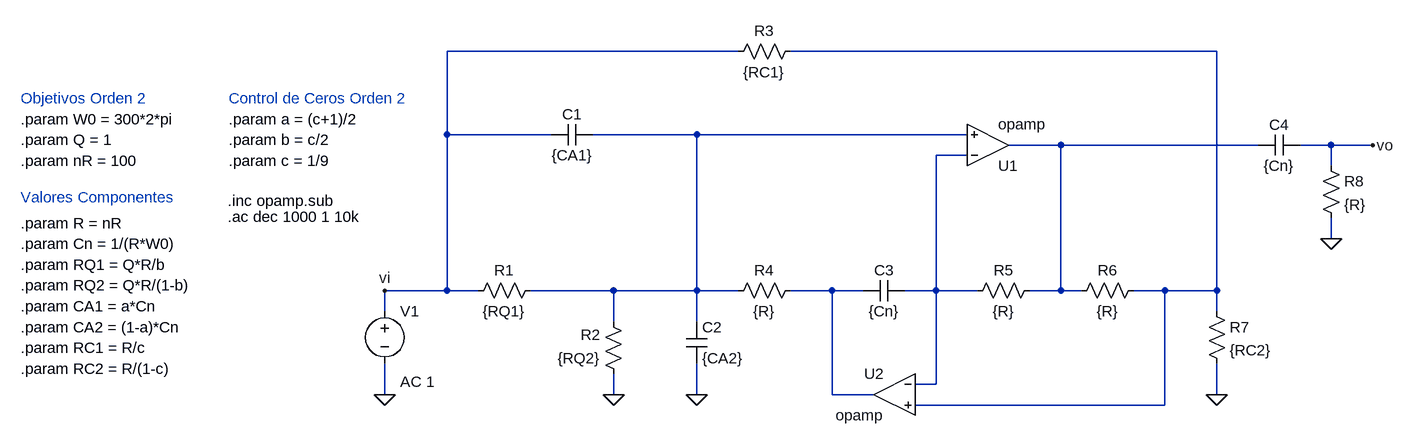
[diagram p0: schematic implementacion2(Schawmann).asc]
implementacion2(Schawmann).asc, the LTspice schematic file:
Version 4
SHEET 1 2268 680
WIRE 992 0 544 0
WIRE 1728 0 1072 0
WIRE 544 128 544 0
WIRE 704 128 544 128
WIRE 928 128 768 128
WIRE 1344 128 928 128
WIRE 1488 144 1408 144
WIRE 1792 144 1488 144
WIRE 1904 144 1856 144
WIRE 1968 144 1904 144
WIRE 1344 160 1296 160
WIRE 1904 176 1904 144
WIRE 1904 288 1904 256
WIRE 544 368 544 128
WIRE 544 368 448 368
WIRE 592 368 544 368
WIRE 800 368 672 368
WIRE 928 368 928 128
WIRE 928 368 800 368
WIRE 992 368 928 368
WIRE 1136 368 1072 368
WIRE 1184 368 1136 368
WIRE 1296 368 1296 160
WIRE 1296 368 1248 368
WIRE 1360 368 1296 368
WIRE 1488 368 1488 144
WIRE 1488 368 1440 368
WIRE 1520 368 1488 368
WIRE 1648 368 1600 368
WIRE 1728 368 1728 0
WIRE 1728 368 1648 368
WIRE 448 400 448 368
WIRE 1728 400 1728 368
WIRE 800 416 800 368
WIRE 928 416 928 368
WIRE 1296 512 1296 368
WIRE 1296 512 1264 512
WIRE 448 528 448 480
WIRE 800 528 800 496
WIRE 928 528 928 480
WIRE 1136 528 1136 368
WIRE 1200 528 1136 528
WIRE 1728 528 1728 480
WIRE 1648 544 1648 368
WIRE 1648 544 1264 544
FLAG 448 528 0
FLAG 800 528 0
FLAG 928 528 0
FLAG 1728 528 0
FLAG 1904 288 0
FLAG 448 368 vi
FLAG 1968 144 vo
SYMBOL voltage 448 384 R0
WINDOW 123 24 124 Left 2
WINDOW 39 0 0 Left 0
SYMATTR InstName V1
SYMATTR Value ""
SYMATTR Value2 AC 1
SYMBOL res 688 352 R90
WINDOW 0 0 56 VBottom 2
WINDOW 3 32 56 VTop 2
SYMATTR InstName R1
SYMATTR Value {RQ1}
SYMBOL res 1088 352 R90
WINDOW 0 0 56 VBottom 2
WINDOW 3 32 56 VTop 2
SYMATTR InstName R4
SYMATTR Value {R}
SYMBOL res 816 512 R180
WINDOW 0 36 76 Left 2
WINDOW 3 36 40 Left 2
SYMATTR InstName R2
SYMATTR Value {RQ2}
SYMBOL cap 912 416 R0
SYMATTR InstName C2
SYMATTR Value {CA2}
SYMBOL cap 1248 352 R90
WINDOW 0 0 32 VBottom 2
WINDOW 3 32 32 VTop 2
SYMATTR InstName C3
SYMATTR Value {Cn}
SYMBOL res 1456 352 R90
WINDOW 0 0 56 VBottom 2
WINDOW 3 32 56 VTop 2
SYMATTR InstName R5
SYMATTR Value {R}
SYMBOL res 1616 352 R90
WINDOW 0 0 56 VBottom 2
WINDOW 3 32 56 VTop 2
SYMATTR InstName R6
SYMATTR Value {R}
SYMBOL res 1712 384 R0
SYMATTR InstName R7
SYMATTR Value {RC2}
SYMBOL cap 768 112 R90
WINDOW 0 0 32 VBottom 2
WINDOW 3 32 32 VTop 2
SYMATTR InstName C1
SYMATTR Value {CA1}
SYMBOL res 1088 -16 R90
WINDOW 0 0 56 VBottom 2
WINDOW 3 32 56 VTop 2
SYMATTR InstName R3
SYMATTR Value {RC1}
SYMBOL OpAmps\\opamp 1376 208 M180
SYMATTR InstName U1
SYMBOL OpAmps\\opamp 1232 464 M0
SYMATTR InstName U2
SYMBOL cap 1856 128 R90
WINDOW 0 0 32 VBottom 2
WINDOW 3 32 32 VTop 2
SYMATTR InstName C4
SYMATTR Value {Cn}
SYMBOL res 1888 160 R0
SYMATTR InstName R8
SYMATTR Value {R}
TEXT -112 72 Left 2 ;Objetivos Orden 2
TEXT 208 72 Left 2 ;Control de Ceros Orden 2
TEXT -112 224 Left 2 ;Valores Componentes
TEXT -112 104 Left 2 !.param W0 = 300*2*pi
TEXT -112 136 Left 2 !.param Q = 1
TEXT -112 168 Left 2 !.param nR = 100
TEXT 208 104 Left 2 !.param a = (c+1)/2
TEXT 208 136 Left 2 !.param b = c/2
TEXT 208 168 Left 2 !.param c = 1/9
TEXT -112 264 Left 2 !.param R = nR
TEXT -112 296 Left 2 !.param Cn = 1/(R*W0)
TEXT -112 328 Left 2 !.param RQ1 = Q*R/b
TEXT -112 360 Left 2 !.param RQ2 = Q*R/(1-b)
TEXT -112 392 Left 2 !.param CA1 = a*Cn
TEXT -112 424 Left 2 !.param CA2 = (1-a)*Cn
TEXT -112 456 Left 2 !.param RC1 = R/c
TEXT -112 488 Left 2 !.param RC2 = R/(1-c)
TEXT 206 254 Left 2 !.ac dec 1000 1 10k
TEXT 206 230 Left 2 !.inc opamp.sub

The netlist it stands for:
* implementacion2(Schawmann).asc
V1 vi 0 AC 1
R1 N002 vi {RQ1}
R4 N005 N002 {R}
R2 0 N002 {RQ2}
C2 N002 0 {CA2}
C3 N004 N005 {Cn}
R5 N003 N004 {R}
R6 N001 N003 {R}
R7 N001 0 {RC2}
C1 N002 vi {CA1}
R3 N001 vi {RC1}
XU1 N004 N002 N003 opamp Aol=100K GBW=10Meg  ; pins invin noninvin out
XU2 N004 N001 N005 opamp Aol=100K GBW=10Meg  ; pins invin noninvin out
C4 vo N003 {Cn}
R8 vo 0 {R}
* Objetivos Orden 2
* Control de Ceros Orden 2
* Valores Componentes
.param W0 = 300*2*pi
.param Q = 1
.param nR = 100
.param a = (c+1)/2
.param b = c/2
.param c = 1/9
.param R = nR
.param Cn = 1/(R*W0)
.param RQ1 = Q*R/b
.param RQ2 = Q*R/(1-b)
.param CA1 = a*Cn
.param CA2 = (1-a)*Cn
.param RC1 = R/c
.param RC2 = R/(1-c)
.ac dec 1000 1 10k
.inc opamp.sub
.backanno
.end

* Results of the author's LTspice run, read from the files saved beside the schematic
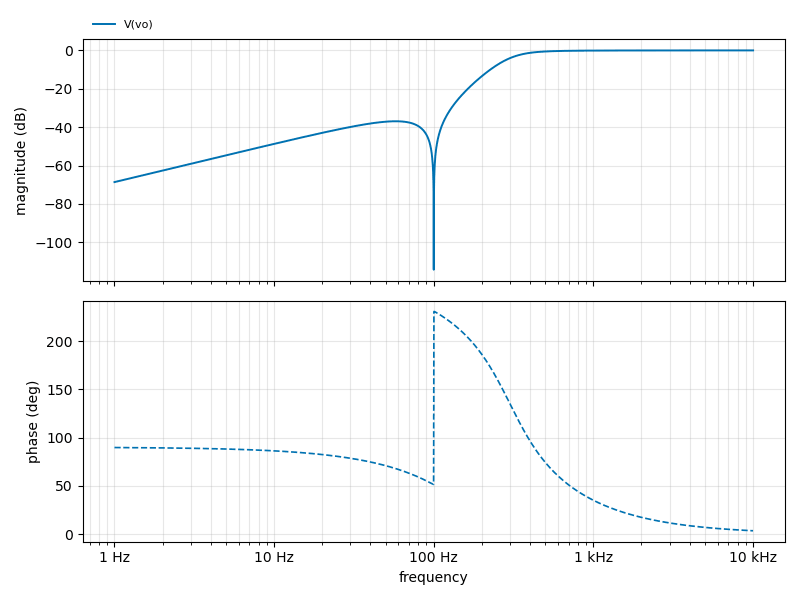
[diagram p1: AC Analysis of implementacion2(Schawmann).asc, plotted from the saved traces]
* AC Analysis, 1 run:
*   V(vo): -68.63 dB at 1 Hz, -0.00 dB at 10 kHz, peak -0.00 dB at 10 kHz, 3 dB below the peak at 323.5 Hz